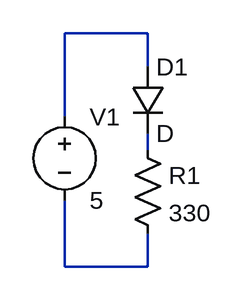
[diagram p0: schematic Draft1.asc]
Draft1.asc, the LTspice schematic file:
Version 4
SHEET 1 880 680
WIRE 112 48 32 48
WIRE 112 80 112 48
WIRE 32 128 32 48
WIRE 112 160 112 144
WIRE 32 272 32 208
WIRE 112 272 112 240
WIRE 112 272 32 272
SYMBOL res 96 144 R0
SYMATTR InstName R1
SYMATTR Value 330
SYMBOL diode 96 80 R0
SYMATTR InstName D1
SYMBOL voltage 32 112 R0
WINDOW 123 0 0 Left 0
WINDOW 39 0 0 Left 0
SYMATTR InstName V1
SYMATTR Value 5

The netlist it stands for:
* Draft1.asc
R1 N002 N003 330
D1 N001 N002 D
V1 N001 N003 5
.model D D
.lib standard.dio
.backanno
.end